# Altium schematic sheet SheetArduinoNPN.SchDoc
size A4
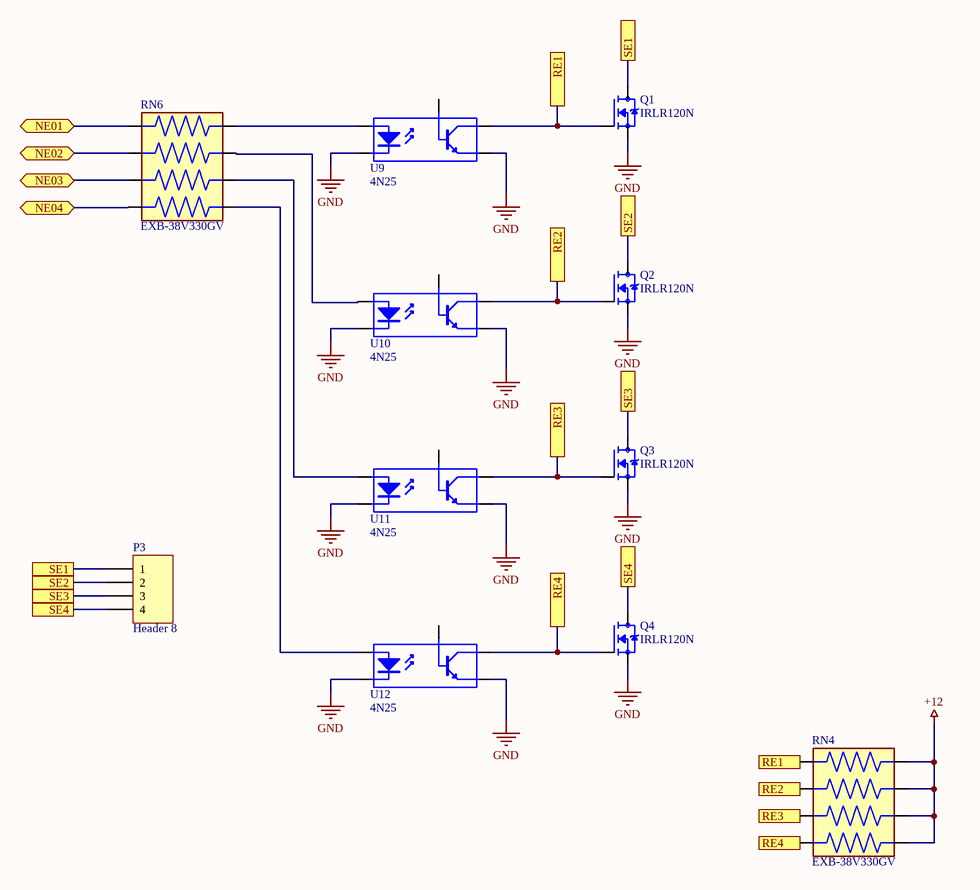
[diagram p0: SheetArduinoNPN.SchDoc]

## Parts
P3  Header 8  [HDR1X4]
Q1  IRLR120N  [DPAK229P990X239-3N]
Q2  IRLR120N  [DPAK229P990X239-3N]
Q3  IRLR120N  [DPAK229P990X239-3N]
Q4  IRLR120N  [DPAK229P990X239-3N]
RN4  EXB-38V330GV  [RESCAXS80P320X160X60-8N]
RN6  EXB-38V330GV  [RESCAXS80P320X160X60-8N]
U9  4N25  [SOP5(6)]
U10  4N25  [SOP5(6)]
U11  4N25  [SOP5(6)]
U12  4N25  [SOP5(6)]

## Ports
NE01 (bidir), NE02 (bidir), NE03 (bidir), NE04 (bidir), RE1, RE2, RE3, RE4, SE1, SE2, SE3, SE4

## Nets
+12: RN4.5 RN4.6 RN4.7 RN4.8
GND: Q1.2(S) Q2.2(S) Q3.2(S) Q4.2(S) U9.3(K) U9.4(E) U10.3(K) U10.4(E) U11.3(K) U11.4(E) U12.3(K) U12.4(E)
NE01: RN6.1 ; port NE01
NE02: RN6.2 ; port NE02
NE03: RN6.3 ; port NE03
NE04: RN6.4 ; port NE04
RE1: Q1.1(G) RN4.1 U9.5(C) ; port RE1
RE2: Q2.1(G) RN4.2 U10.5(C) ; port RE2
RE3: Q3.3(D) RN4.3 U11.5(C) ; port RE3
RE4: Q4.1(G) RN4.4 U12.5(C) ; port RE4
SE1: P3.1 Q1.3(D) ; port SE1
SE2: P3.2 Q2.3(D) ; port SE2
SE3: P3.3 Q3.3(D) ; port SE3
SE4: P3.4 Q4.3(D) ; port SE4
NetRN6_5: RN6.5 U12.1(A)
NetRN6_6: RN6.6 U11.1(A)
NetRN6_7: RN6.7 U10.1(A)
NetRN6_8: RN6.8 U9.1(A)

Not connected (* = marked no-connect by the designer): U9 6(B); U10 6(B); U11 6(B); U12 6(B)

## Library data of the parts
P3 = Header 4: Header, 4-Pin; LatestRevisionDate: 17-Jul-2002; LatestRevisionNote: Re-released for DXP Platform.; Publisher: Altium Limited
Q1-Q4 = IRLR120N: N-Channel 100V 10A _Tc_ 48W _Tc_ Surface Mount D-Pak; MF: Infineon Technologies; Price: None; SnapEDA_Link: https://www.snapeda.com/parts/IRLR120N/Infineon%20Technologies/view-part/182771/?ref=snap; Package: TO-252 International Rectifier; Availability: Unavailable; MP: IRLR120N; Value: *
RN4 RN6 = EXB-38V330GV: Resistor Array, Chip, 4 elements CONVEX 1206 2%; MF: Panasonic; SnapEDA_Link: https://www.snapeda.com/parts/EXB-38V330GV/Panasonic/view-part/1421932/?ref=snap; Price: None; MP: EXB-38V330GV; Package: 0603 Panasonic; Value: *; Check_prices: https://www.snapeda.com/parts/EXB-38V330GV/Panasonic/view-part/1421932/?ref=eda; Availability: Bad
U9-U12 = Optoisolator2: 5 Pin Mini Flat Pack Optocoupler; Published: 24-Mar-1999; LatestRevisionDate: 04-Mar-2005; LatestRevisionNote: PCB Footprint replaced, Sch pins re-numbered.; DatasheetVersion: Apr-2004; PackageReference: SOP5(6); Publisher: Altium Limited; PackageDescription: Small Outline; 6 Leads (1 Absent); Body Width 4.4 mm; Pitch 1.27 mm